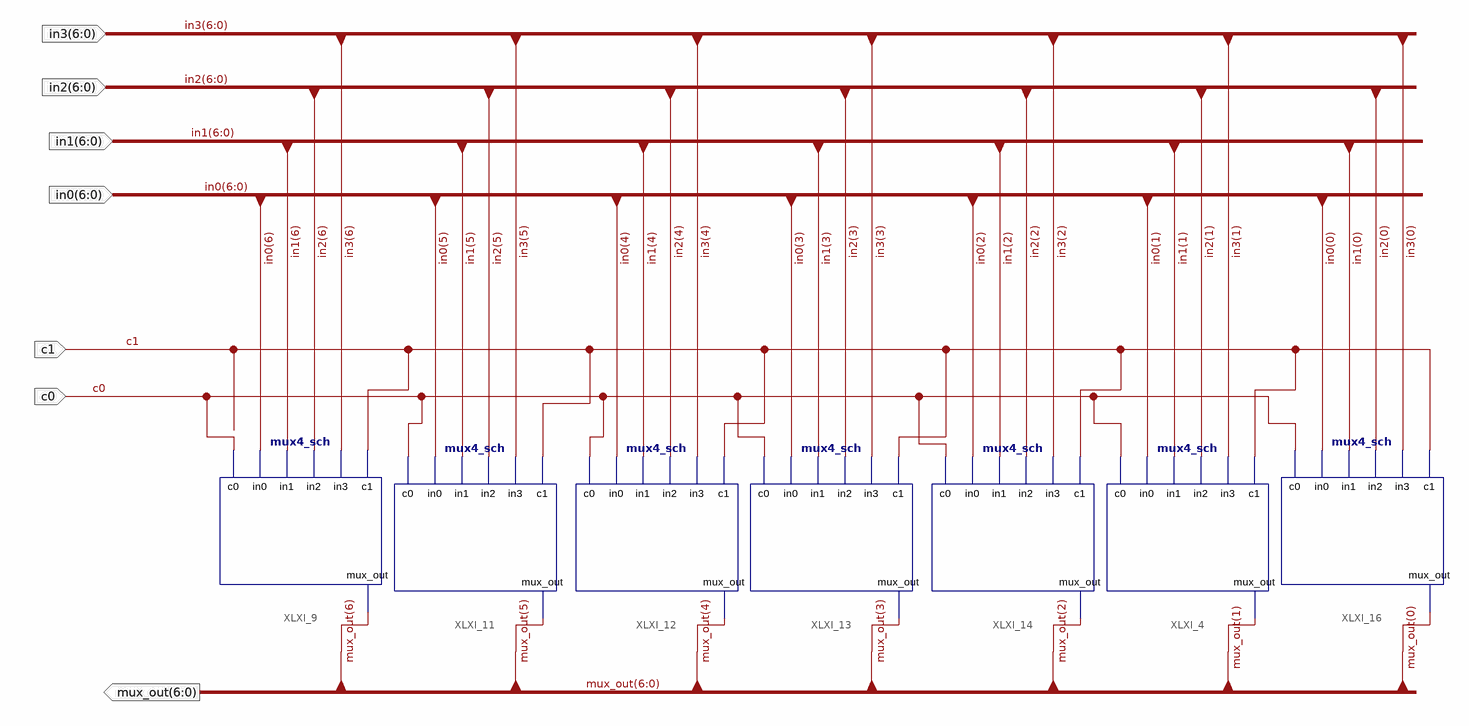
[diagram p0: schematic sheet 1]
// Xilinx ISE schematic mux4_7bit_sch.sch (spartan3e) as structural Verilog: 7 symbols, 7 ports
module mux4_7bit_sch (
  input  [6:0] in1,
  input  [6:0] in2,
  input  [6:0] in3,
  input  [6:0] in0,
  input  c0,
  input  c1,
  output [6:0] mux_out
);

  mux4_sch XLXI_9 (.c1(c1), .in3(in3[6]), .in2(in2[6]), .in1(in1[6]), .in0(in0[6]), .c0(c0), .mux_out(mux_out[6]));
  mux4_sch XLXI_11 (.c1(c1), .in3(in3[5]), .in2(in2[5]), .in1(in1[5]), .in0(in0[5]), .c0(c0), .mux_out(mux_out[5]));
  mux4_sch XLXI_12 (.c1(c1), .in3(in3[4]), .in2(in2[4]), .in1(in1[4]), .in0(in0[4]), .c0(c0), .mux_out(mux_out[4]));
  mux4_sch XLXI_13 (.c1(c1), .in3(in3[3]), .in2(in2[3]), .in1(in1[3]), .in0(in0[3]), .c0(c0), .mux_out(mux_out[3]));
  mux4_sch XLXI_14 (.c1(c1), .in3(in3[2]), .in2(in2[2]), .in1(in1[2]), .in0(in0[2]), .c0(c0), .mux_out(mux_out[2]));
  mux4_sch XLXI_4 (.c1(c1), .in3(in3[1]), .in2(in2[1]), .in1(in1[1]), .in0(in0[1]), .c0(c0), .mux_out(mux_out[1]));
  mux4_sch XLXI_16 (.c1(c1), .in3(in3[0]), .in2(in2[0]), .in1(in1[0]), .in0(in0[0]), .c0(c0), .mux_out(mux_out[0]));
endmodule
